# Altium schematic sheet CAN_Transceiver.SchDoc: CAN Transceiver board for STM32F4-Discovery
size A3; Organization: Laboratoire de Systèmes Robootiques; Address1: Dorian Konrad; Address2: STI-IMT-LSRO1; Address3: EPFL; Address4: CH-1015 LAUSANNE; DocumentNumber: Init DocumentNumber in DocParam; Revision: A; SheetNumber: 1; SheetTotal: 1; ApprovedBy: Init ApprovedBy in DocParam; CheckedBy: Init CheckedBy in DocParam; Author: Init Author in DocParam; CompanyName: Init CompanyName in DocParam; DrawnBy: Init DrawBy in DocParam; Engineer: Init Engineer in DocParam; DocumentName: Init DocumentName in DocParam; ProjectName: CAN Transceiver
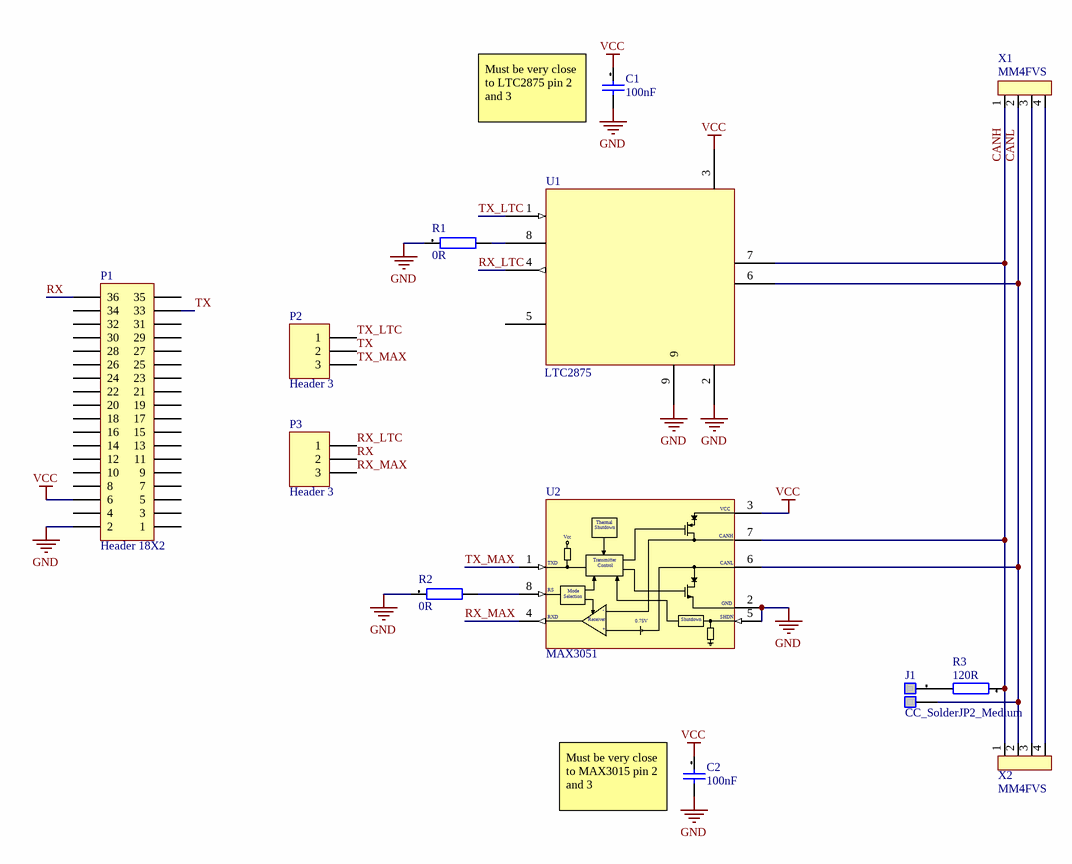
[diagram p0: CAN_Transceiver.SchDoc]

## Parts
C1  100nF  [CAPC1005X05L]
C2  100nF  [CAPC1005X05L]
J1  CC_SolderJP2_Medium  [CC_SolderJP_M]  (no BOM)
P1  Header 18X2  [HDR2X18]
P2  Header 3  [HDR1X3]
P3  Header 3  [HDR1X3]
R1  0R  [RESC1608X06L]
R2  0R  [RESC1608X06L]
R3  120R  [RESC1608X06L]
U1  LTC2875
U2  MAX3051  [SOT-23, 8L]
X1  MM4FVS  [TYCO_7-188275-4]
X2  MM4FVS  [TYCO_7-188275-4]

## Nets
GND: C1.2 C2.2 P1.2 R1.1 R2.1 U1.2 U1.9 U2.2(GND) U2.5(SHDN)
VCC: C1.1 C2.1 P1.6 U1.3 U2.3(VCC)
CANH: R3.1 U1.7 U2.7(CANH) X1.1 X2.1
CANL: J1.2 U1.6 U2.6(CANL) X1.2 X2.2
RX: P1.36 P3.2
RX_LTC: P3.1 U1.4
RX_MAX: P3.3 U2.4(RXD)
TX: P1.33 P2.2
TX_LTC: P2.1 U1.1
TX_MAX: P2.3 U2.1(TXD)
NetJ1_1: J1.1 R3.2
NetR1_2: R1.2 U1.8
NetR2_2: R2.2 U2.8(RS)
NetX1_3: X1.3 X2.3
NetX1_4: X1.4 X2.4

Not connected (* = marked no-connect by the designer): P1 1 3 4 5 7 8 9 10 11 12 13 14 15 16 17 18 19 20 21 22 23 24 25 26 27 28 29 30 31 32 34 35; U1 5

## Notes on the sheet
- (near C1) Must be very close to LTC2875 pin 2 and 3
- (near C2) Must be very close to MAX3015 pin 2 and 3
- Date:
- Project
- Part
- Revision:
- File :
- Page
- de
- (in symbol MAX3051) Thermal; Shutdown; Vcc; Transmitter; Control; Mode; Selection; -; Receiver; 0.75V; +

## Library data of the parts
C1 C2 = 100nF[[/\]]0402[[/\]]1: Capacitor; Manufacturer: Kemet; Manufacturer Nr: C0402C104K4RAC; Preference: 1; Tolerance +: +10; Tolerance -: -10; Dielectric: X7R; Voltage: 16; MaxTemperature: +125; MinTemperature: -55; Quant_1: 10; Quant_2: 100; Quant_3: 1000; Quant_4: 4000; Currentie: CHF; Size: 0402; Footprint Acort: 0402; Supplier: Farnell; Supplier Nr: 1288252; ComponentLink2Description: Farnell link; ComponentLink2URL: http://ch.farnell.com/jsp/displayProduct.jsp?sku=1288252; Price_1: 0,047; Price_2: 0,041; Price_3: 0,038; Price_4: 0,037; ROHS: True; DateLastUpdate: 2007-12-03 / 14:22:29
J1 = CC_SolderJP2_Medium: Medium Solder Jumper 2 leads; Preference: 1; Footprint Acort: ToDefine; DateLastUpdate: 2007-11-06 / 20:24:14
P1 = Header 18X2: Header, 18-Pin, Dual row; LatestRevisionDate: 17-Jul-2002; LatestRevisionNote: Re-released for DXP Platform.; Publisher: Altium Limited
P2 P3 = Header 3: Header, 3-Pin; LatestRevisionDate: 17-Jul-2002; LatestRevisionNote: Re-released for DXP Platform.; Publisher: Altium Limited
R1 R2 = 0R[[/\]]0603[[/\]]1: Resistor; Manufacturer: Vishay; Manufacturer Nr: D11CRCW06030B000Z; Tolerance: +/-1; Preference: 1; Power: 0.1; Voltage: 75; Current: 1.5; ppm/K: +/-200; Quant_1: 10; Quant_2: 100; Quant_3: 500; Currentie: CHF; Size: 0603; Footprint Acort: 0603; Supplier: Distrelec; Supplier Nr: 715151; ComponentLink2Description: Distrelec link; ComponentLink2URL: http://www.distrelec.com/ishopWebFront/search/luceneSearch.do?dispatch=find&showImage=on&artnrPhrase=715151; ROHS: True; Price_1: 0,0592; Price_2: 0,0398; Price_3: 0,0247; DateLastUpdate: 2007-12-03 / 16:30:07
R3 = 120R[[/\]]0603[[/\]]1: Resistor; Manufacturer: Vishay; Manufacturer Nr: D11CRCW06030B1200F; Tolerance: +/-1; Preference: 1; Power: 0.1; Voltage: 75; Current: 1.5; ppm/K: +/-100; Quant_1: 10; Quant_2: 100; Quant_3: 500; Currentie: CHF; Size: 0603; Footprint Acort: 0603; Supplier: Distrelec; Supplier Nr: 715566; ComponentLink2Description: Distrelec link; ComponentLink2URL: http://www.distrelec.com/ishopWebFront/search/luceneSearch.do?dispatch=find&showImage=on&artnrPhrase=715566; ROHS: True; Price_1: 0,0538; Price_2: 0,0323; Price_3: 0,0204; DateLastUpdate: 2007-12-03 / 16:30:10
X1 X2 = MM4FVS[[/\]]1: Micro-Match 4 pins Female on board Vertical Smd connector; Manufacturer: Tyco; Manufacturer Nr: 7-188275-4; Preference: 1; Currentie: CHF; Quant_1: 10; Quant_2: 250; Quant_3: 900; Footprint Acort: ToDefine; ComponentLink1Description: Datasheet; ComponentLink1URL: http://ecommas.tycoelectronics.com/commerce/DocumentDelivery/DDEController?Action=showdoc&DocId=Customer+Drawing%7F188275%7FR%7Fpdf%7FEnglish%7FC_188275_R.pdf; Supplier: Farnell; Supplier Nr: 3784710; ComponentLink2Description: Farnell link; ComponentLink2URL: http://fr.farnell.com/jsp/displayProduct.jsp?sku=3784710; ROHS: True; Type: SMD; Orientation: Vertical; DateLastUpdate: 2007-12-04 / 09:15:26; Price_1: 0,944; Price_2: 0,838; Price_3: 0,745
U2 = MAX3051: Datasheet: http://datasheets.maximintegrated.com/en/ds/MAX3051.pdf